# EAGLE design Wallboxsteuerung-WEMOS-ohne-shelly2 (EAGLE 7.5.0)
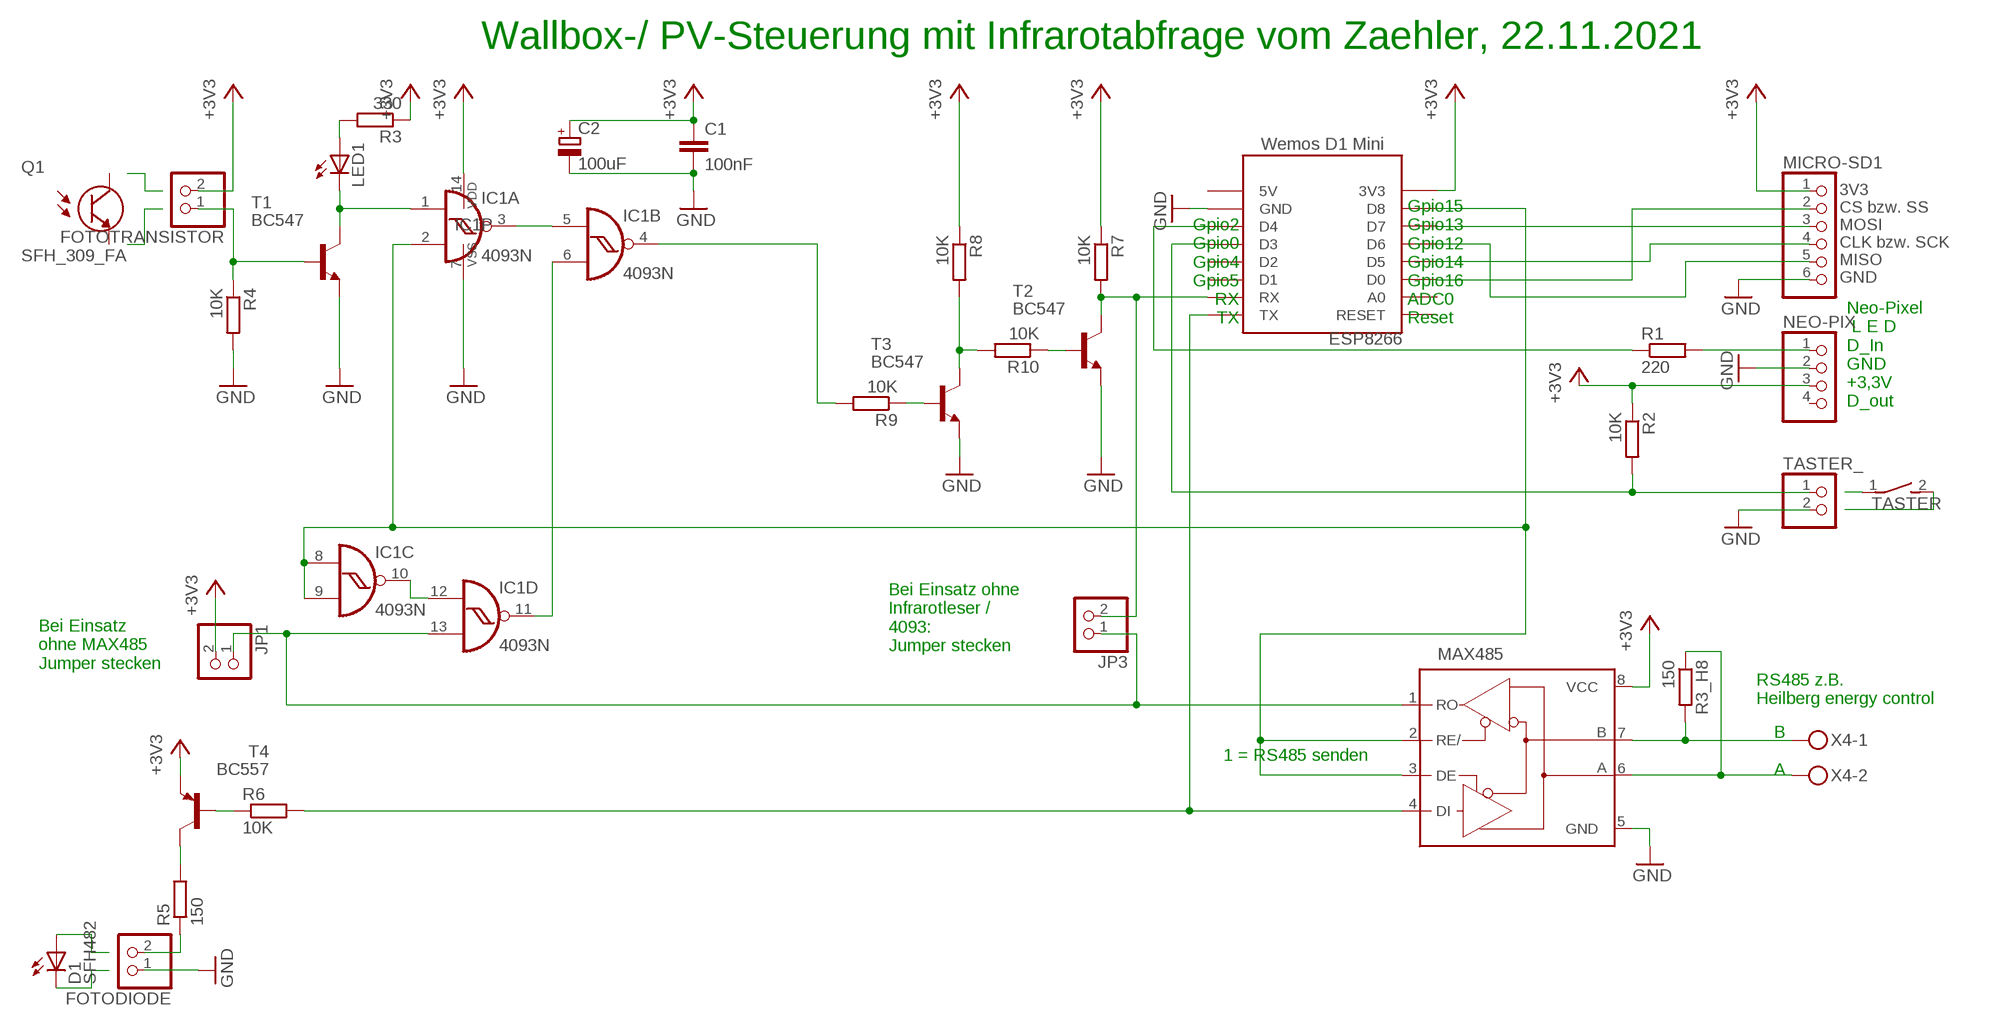
[diagram p0: schematic, sheet 1]

## Parts
C1  100nF  C-EU050-045X075  [C050-045X075]
C2  100uF  CPOL-EUE5-6  [E5-6]
D1  SFH482  [SFH482]
ESP8266  Wemos D1 Mini  WEMOS-D1-MINI  [WEMOS-D1-MINI]
FOTODIODE  PINHD-1X2  [1X02]
FOTOTRANSISTOR  PINHD-1X2  [1X02]
IC1  4093N  [DIL14]
JP1  PINHD-1X2  [1X02]
JP3  PINHD-1X2  [1X02]
LED1  LED5MM  [LED5MM]
MAX485  MAX3468CPA  [DIL08]
MICRO-SD1  PINHD-1X6  [1X06]
NEO-PIX  PINHD-1X4  [1X04]
Q1  SFH_309_FA  [XDCR_SFH_309_FA]
R1  220  R-EU_0309/V  [0309V]
R2  10K  R-EU_0309/V  [0309V]
R3  330  R-EU_0309/V  [0309V]
R3_H8  150  R-EU_0309/V  [0309V]
R4  10K  R-EU_0309/V  [0309V]
R5  150  R-EU_0309/V  [0309V]
R6  10K  R-EU_0309/V  [0309V]
R7  10K  R-EU_0309/V  [0309V]
R8  10K  R-EU_0309/V  [0309V]
R9  10K  R-EU_0309/V  [0309V]
R10  10K  R-EU_0309/V  [0309V]
T1  BC547  [TO92]
T2  BC547  [TO92]
T3  BC547  [TO92]
T4  BC557  [TO92]
TASTER  DS01E  [DS-01]
TASTER_  PINHD-1X2  [1X02]
X4  MKDSN1,5/2-5,08  [MKDSN1,5/2-5,08]

## Nets
+3V3: C1.1 C2.+ ESP8266.3V3 FOTOTRANSISTOR.2 IC1.14(P:VDD) JP1.2 MAX485.8(VCC) MICRO-SD1.1 NEO-PIX.3 R2.1 R3.1 R7.1 R8.1 T4.1(E)
GND: C1.2 C2.- ESP8266.GND FOTODIODE.1 IC1.7(P:VSS) MAX485.5(GND) MICRO-SD1.6 NEO-PIX.2 R4.2 T1.1(E) T2.1(E) T3.1(E) TASTER_.2
N$1: ESP8266.D4 R1.1
N$2: FOTOTRANSISTOR.1 R4.1 T1.2(B)
N$3: IC1.1(A:I0) LED1.K(C) T1.3(C)
N$4: IC1.3(A:O) IC1.5(B:I0)
N$5: ESP8266.D8 IC1.2(A:I1) IC1.8(C:I0) IC1.9(C:I1) MAX485.2(RE/) MAX485.3(DE)
N$6: R5.2 T4.3(C)
N$7: IC1.4(B:O) R9.2
N$8: ESP8266.TX MAX485.4(DI) R6.2
N$9: IC1.6(B:I1) IC1.11(D:O)
N$11: FOTODIODE.2 R5.1
N$12: TASTER.2
N$13: D1.A
N$14: R6.1 T4.2(B)
N$15: TASTER.1
N$16: IC1.10(C:O) IC1.12(D:I0)
N$17: D1.K(C)
N$27: ESP8266.RX JP3.2 R7.2 T2.3(C)
N$29: R8.2 R10.2 T3.3(C)
N$30: R10.1 T2.2(B)
N$31: R9.1 T3.2(B)
N$32: LED1.A R3.2
N$33: IC1.13(D:I1) JP1.1 JP3.1 MAX485.1(RO)
N$39: NEO-PIX.1 R1.2
N$40: ESP8266.D3 R2.2 TASTER_.1
N$42: ESP8266.D0 MICRO-SD1.2
N$43: ESP8266.D7 MICRO-SD1.3
N$44: ESP8266.D5 MICRO-SD1.4
N$45: ESP8266.D6 MICRO-SD1.5
N$46: MAX485.7(B) R3_H8.2 X4.1
N$47: MAX485.6(A) R3_H8.1 X4.2
Unconnected: ESP8266.5V ESP8266.A0 ESP8266.D1 ESP8266.D2 ESP8266.RESET NEO-PIX.4 Q1.1(E) Q1.2(C)

## Notes on the sheet
- Wallbox-/ PV-Steuerung mit Infrarotabfrage vom Zaehler, 22.11.2021
- 3V3
  CS bzw. SS
  MOSI
  CLK bzw. SCK
  MISO
  GND
- Gpio2
  Gpio0
  Gpio4
  Gpio5
  RX
  TX
- Gpio15
  Gpio13
  Gpio12
  Gpio14
  Gpio16
  ADC0
  Reset
- Neo-Pixel
   L E D
  D_In
  GND
  +3,3V
  D_out
- Bei Einsatz ohne
  Infrarotleser /
  4093:
  Jumper stecken
- Bei Einsatz
  ohne MAX485
  Jumper stecken
- RS485 z.B. 
  Heilberg energy control
- 1 = RS485 senden
- B
  
  A

## Library data of the parts
C1 = rcl:C-EU: CAPACITOR, European symbol
C2 = rcl:CPOL-EU: POLARIZED CAPACITOR, European symbol
D1 = led:SFH482: IR LED infrared emitting diode, Infineon
ESP8266 = uwe_esp8266modules1:WEMOS-D1-MINI: WeMos.cc D1 mini ESP8266 module
FOTODIODE FOTOTRANSISTOR JP1 JP3 TASTER_ = pinhead:PINHD-1X2: PIN HEADER
IC1 = 40xx:4093: Quad 2-input NAND schmitt trigger
LED1 = led:LED: LED OSRAM: - CHIPLED LG R971, LG N971, LY N971, LG Q971, LY Q971, LO R971, LY R971 LH N974, LH R974 LS Q976, LO Q976, LY Q976 LO Q996 - Hyper CHIPLED LW Q18S LB Q993, LB Q99A, LB R99A - SideLED LS A670, LO A670, LY A670, LG A670, LP A670 LB A673, LV A673, LT A673, LW A673 LH A674 LY A675 LS A676, LA A676, LO A676, LY A676, LW A676 LS A679, LY A679, LG A679 - Hyper Micro SIDELED® LS Y876, LA Y876, LO Y876, LY Y876 LT Y87S - SmartLED LW L88C, LW L88S LB L89C, LB L89S, LG L890 LS L89K, LO L89K, LY L89K LS L896, LA L896, LO L896, LY L896 - TOPLED LS T670, LO T670, LY T670, LG T670, LP T670 LSG T670, LSP T670, LSY T670, LOP T670, LYG T670 LG T671, LOG T671, LSG T671 LB T673, LV T673, LT T673, LW T673 LH T674 LS T676, LA T676, LO T676, LY T676, LB T676, LH T676, LSB T676, LW T676 LB T67C, LV T67C, LT T67C, LS T67K, LO T67K, LY T67K, LW E67C LS E67B, LA E67B, LO E67B, LY E67B, LB E67C, LV E67C, LT E67C LW T67C LS T679, LY T679, LG T679 LS T770, LO T770, LY T770, LG T770, LP T770 LB T773, LV T773, LT T773, LW T773 LH T774 LS E675, LA E675, LY E675, LS T675 LS T776, LA T776, LO T776, LY T776, LB T776 LHGB T686 LT T68C, LB T68C - Hyper Mini TOPLED® LB M676 - Mini TOPLED Santana® LG M470 LS M47K, LO M47K, LY M47K Source: http://www.osram.convergy.de LUXEON: - LUMILED® LXK2-PW12-R00, LXK2-PW12-S00, LXK2-PW14-U00, LXK2-PW14-V00 LXK2-PM12-R00, LXK2-PM12-S00, LXK2-PM14-U00 LXK2-PE12-Q00, LXK2-PE12-R00, LXK2-PE12-S00, LXK2-PE14-T00, LXK2-PE14-U00 LXK2-PB12-K00, LXK2-PB12-L00, LXK2-PB12-M00, LXK2-PB14-N00, LXK2-PB14-P00, LXK2-PB14-Q00 LXK2-PR12-L00, LXK2-PR12-M00, LXK2-PR14-Q00, LXK2-PR14-R00 LXK2-PD12-Q00, LXK2-PD12-R00, LXK2-PD12-S00 LXK2-PH12-R00, LXK2-PH12-S00 LXK2-PL12-P00, LXK2-PL12-Q00, LXK2-PL12-R00 Source: www.luxeon.com KINGBRIGHT: KA-3528ASYC Source: www.kingbright.com
MAX485 = maxim:MAX34*: +5V, Fail-Safe, 40Mbps, Profibus RS-485/RS-422 Transceivers Source: MAX3465-MAX3469.pdf; OC_FARNELL: unknown; OC_NEWARK: unknown
MICRO-SD1 = pinhead:PINHD-1X6: PIN HEADER
NEO-PIX = pinhead:PINHD-1X4: PIN HEADER
Q1 = SFH_309_FA-V7:SFH_309_FA: Phototransistor IR Chip Silicon 900nm 2-Pin T-1; MANUFACTURER: OSRAM; PARTREV: 1.3; STANDARD: Manufacturer Recommendations
R1-R3 R3_H8 R4-R10 = rcl:R-EU_: RESISTOR, European symbol
T1-T3 = transistor-neu-to92:BC547: NPN TRANSISTOR
T4 = transistor-pnp:BC557: PNP Transistor
TASTER = switch-dil:DS01E: DIL/CODE SWITCH; OC_FARNELL: unknown; OC_NEWARK: unknown
X4 = con-phoenix-508:MKDSN1,5/2-5,08: MKDSN 1,5/ 2-5,08 Printklemme Nennstrom: 13,5 A Nennspannung: 250 V Rastermaß: 5,08 mm Polzahl: 2 Anschlussart: Schraubanschluss Montage: Löten Anschlussrichtung Leiter/Platine: 0 ° Artikelnummer: 1729128 Source: http://eshop.phoenixcontact.com .. 1729128.pdf

## Board
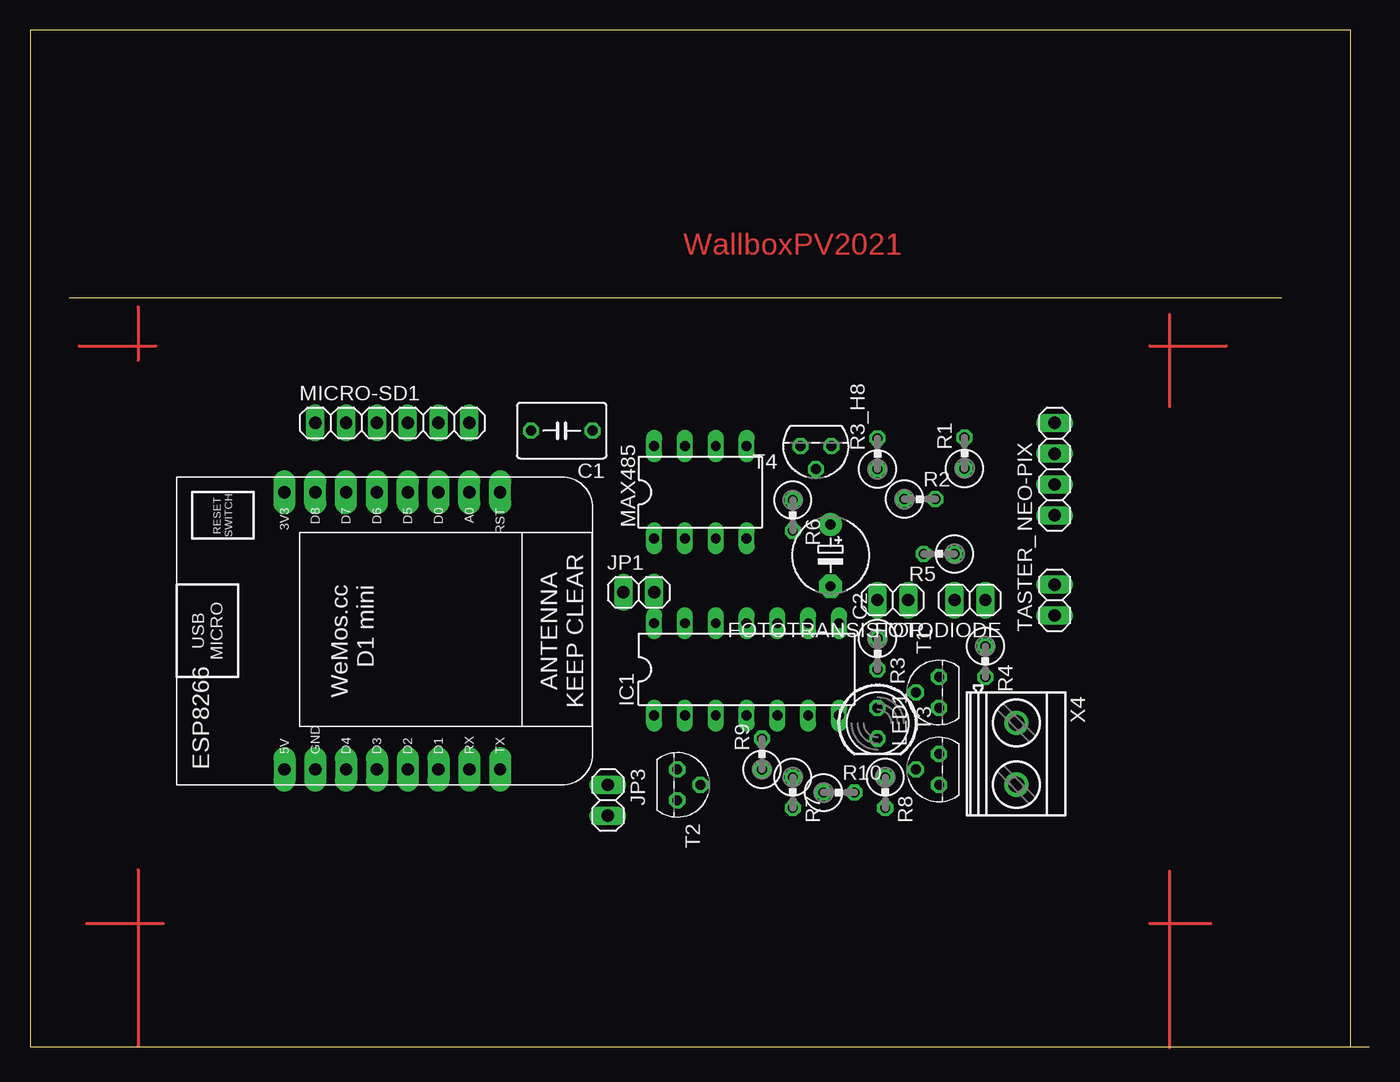
[diagram p1: board, top side]
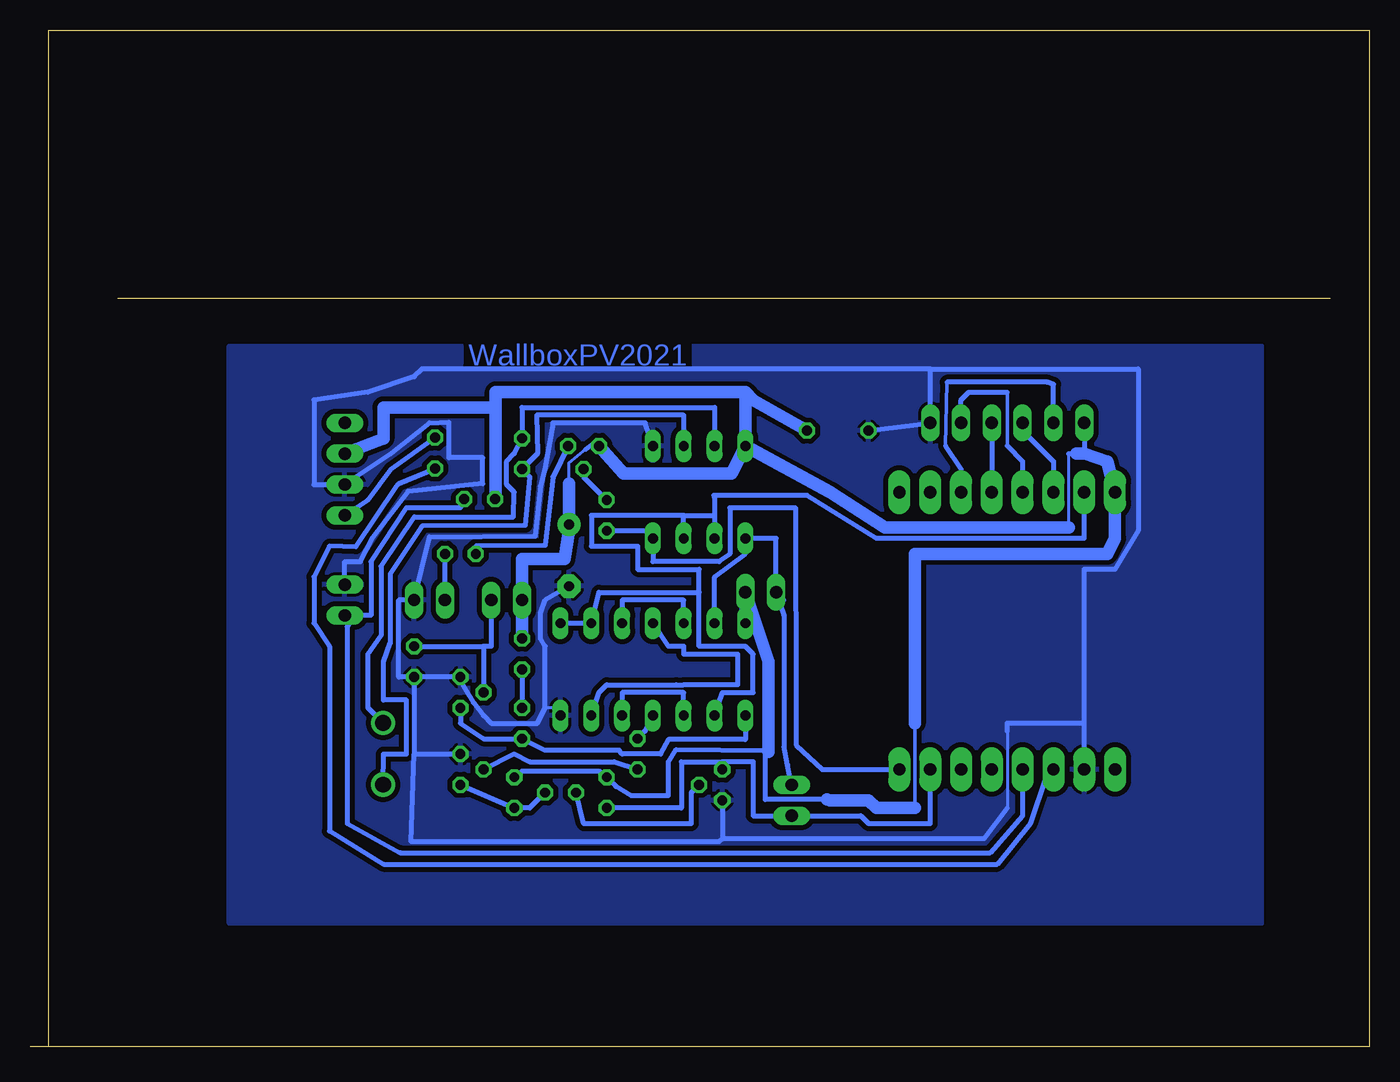
[diagram p2: board, bottom side, seen from below]

Size 110.39 x 83.81 mm. Coordinates in mm from the lower left corner, seen from the top.
Outline: 108.89,0 108.89,83.81 0,83.81 0,0 108.89,0
Outline: 108.89,0 110.39,0
Outline: 103.2,61.74 3.2,61.74
Copper layers (1*16): Top 0.035mm / dielectric 1.5mm / Bottom 0.035mm
Design rules "default": minimum track width 10mil, minimum drill 24mil, track to track 8mil, track to pad 8mil, pad to pad 8mil, via to via 8mil, smd to smd 8mil, copper to edge 40mil, drill to drill 8mil, minimum pad ring 10mil, minimum via ring 8mil, stop-mask expansion 4mil, vias tented up to drill 0mil, thermal gap 10mil

### Footprints (pad centres in the part's own frame; a part is rotated, then mirrored left to right if it is on the bottom)
C050-045X075 = drill 0.813 octagon: 1 -2.54,0; 2 2.54,0
E5-6 = drill 0.813 pad 1.905: + -2.54,0 | drill 0.813 pad 1.905 octagon: - 2.54,0
SFH482 = drill 0.813 long: A -1.27,0; K 1.27,0
WEMOS-D1-MINI = drill 1.016 pad 1.829 long: 3V3 -10.16,-10.16; 5V 12.7,-10.16; A0 -10.16,5.08; D0 -10.16,2.54; D1 12.7,2.54; D2 12.7,0; D3 12.7,-2.54; D4 12.7,-5.08; D5 -10.16,0; D6 -10.16,-2.54; D7 -10.16,-5.08; D8 -10.16,-7.62; GND 12.7,-7.62; RESET -10.16,7.62; RX 12.7,5.08; TX 12.7,7.62
1X02 = drill 1.016 long: 1 -1.27,0; 2 1.27,0
DIL14 = drill 0.813 long: 1 -7.62,-3.81; 2 -5.08,-3.81; 3 -2.54,-3.81; 4 0,-3.81; 5 2.54,-3.81; 6 5.08,-3.81; 7 7.62,-3.81; 8 7.62,3.81; 9 5.08,3.81; 10 2.54,3.81; 11 0,3.81; 12 -2.54,3.81; 13 -5.08,3.81; 14 -7.62,3.81
LED5MM = drill 0.813 octagon: A -1.27,0; K 1.27,0
DIL08 = drill 0.813 long: 1 -3.81,-3.81; 2 -1.27,-3.81; 3 1.27,-3.81; 4 3.81,-3.81; 5 3.81,3.81; 6 1.27,3.81; 7 -1.27,3.81; 8 -3.81,3.81
1X06 = drill 1.016 long: 1 -6.35,0; 2 -3.81,0; 3 -1.27,0; 4 1.27,0; 5 3.81,0; 6 6.35,0
1X04 = drill 1.016 long: 1 -3.81,0; 2 -1.27,0; 3 1.27,0; 4 3.81,0
XDCR_SFH_309_FA = drill 1 pad 2: 1 -1.27,0; 2 1.27,0
0309V = drill 0.813 octagon: 1 -1.27,0; 2 1.27,0
TO92 = drill 0.813 octagon: 1 1.27,0; 2 0,1.905; 3 -1.27,0
DS-01 = drill 0.813 long: 1 0,-3.81; 2 0,3.81
MKDSN1,5/2-5,08 = drill 1.3 pad 2: 1 -2.561,0.025; 2 2.519,0.025

### Placement (x,y rotation side)
C1  43.81,50.8 180 top
C2  65.98,40.51 270 top
D1  -89.53,-55.88 0 top  (outside the outline)
ESP8266  31.12,35.56 270 top
FOTODIODE  77.47,36.83 180 top
FOTOTRANSISTOR  71.12,36.83 180 top
IC1  59.05,31.11 0 top
JP1  50.16,37.46 0 top
JP3  47.62,20.32 270 top
LED1  69.85,26.67 270 top
MAX485  55.24,45.72 0 top
MICRO-SD1  29.84,51.44 0 top
NEO-PIX  84.45,47.62 90 top
Q1  -97.16,-55.88 0 top  (outside the outline)
R1  77.03,48.96 90 top
R2  73.34,45.15 0 top
R3  69.85,32.38 270 top
R3_H8  69.85,48.89 90 top
R4  78.74,31.75 270 top
R5  74.93,40.64 180 top
R6  62.87,43.81 270 top
R7  62.87,20.95 270 top
R8  70.48,20.95 270 top
R9  60.33,24.13 90 top
R10  66.67,20.95 0 top
T1  74.93,29.21 90 top
T2  53.34,21.59 270 top
T3  74.93,22.86 90 top
T4  64.77,49.53 180 top
TASTER  -71.75,-11.43 0 top  (outside the outline)
TASTER_  84.45,36.83 90 top
X4  81.28,24.13 270 top

### Tracks (layer width: path | path; a pad name or v marks a point on that pad's centre or on a via)
+3V3
  Bottom 0.254: 24.77,42.8 24.77,48.89 | 65.98,46.42 65.98,48.13 64.58,49.28
  Bottom 0.305: 37.47,26.67 37.47,19.68
  Bottom 0.406: MICRO-SD1.1 23.5,48.89 | 24.77,48.89 24.13,48.89 | 64.58,49.28 63.75,49.91 T4.1 | 44.7,20.38 49.78,20.38 49.78,24.45 | 49.78,24.45 49.53,24.32 49.53,24.13 49.78,24.45 | 49.78,24.45 57.15,24.51 57.79,23.49 57.79,20.7 60.83,20.7 62.1,21.46 63.5,22.73 | 63.5,22.73 R7.1 | R8.1 69.85,22.73 63.5,22.73 | 72.01,45.4 71.75,45.72 R2.1 | C2.+ 65.98,42.55
  Bottom 1.016: MAX485.8 44.45,45.72 39.94,42.8 24.77,42.8 | 24.13,48.89 23.5,48.89 21.59,48.26 ESP8266.3V3 20.95,41.91 21.59,40.64 37.47,40.64 37.47,26.67 | IC1.14 JP1.2 49.53,31.75 49.53,24.32 | T4.1 61.47,47.24 52.58,47.24 MAX485.8 | R3.1 FOTOTRANSISTOR.2 69.85,40.2 66.36,40.2 65.98,42.55 65.98,46.42 | 51.44,53.98 72.01,53.98 72.01,52.7 | 51.44,53.98 50.8,53.34 C1.1 | 51.44,53.98 MAX485.8 | 72.01,45.4 72.01,52.7 | 37.47,19.68 40.64,19.68 41.27,20.32 44.45,20.32 44.7,20.38 | 72.01,52.7 81.28,52.7 81.28,50.16 NEO-PIX.3
GND
  Bottom 0.254: 66.67,27.94 67.94,27.94 | 29.84,26.67 29.84,19.68
  Bottom 0.406: R4.2 T1.1 74.99,30.42 74.99,30.29 73.85,28.38 73.03,27.3 72.39,26.67 68.58,26.67 67.94,27.94 67.94,33.02 68.33,33.66 68.33,35.75 67.94,36.83 C2.- | IC1.7 66.67,27.94 | 36.2,55.88 19.05,55.88 19.05,42.55 20.95,39.37 23.5,39.37 23.5,26.67 | MAX485.5 59.69,51.44 67.31,51.44 67.94,47.75 68.33,46.23 68.77,42.1 77.47,42.04 FOTODIODE.1 80.01,36.83 80.01,30.48 R4.2 | TASTER_.2 84.45,40.01 83.19,40.01 82.17,41.97 79.25,45.78 73.09,46.42 73.09,48.58 75.88,48.58 75.88,51.5 77.47,51.44 80.64,48.89 NEO-PIX.2 87,46.35 87,53.34 82.55,53.98 78.74,55.24 78.11,55.88 36.2,55.88 | 36.2,55.88 MICRO-SD1.6 C1.2 | T2.1 53.34,17.14 | 53.34,17.14 53.59,16.89 78.99,16.89 78.74,24.13 | 78.74,24.13 T3.1 | R4.2 78.74,24.13 | 23.5,26.67 29.84,26.67 29.84,26.04 | 29.84,19.68 31.75,17.14 53.34,17.14 | ESP8266.GND 23.5,26.67
  pour Bottom (isolate 0.406): 8.89,57.78 8.89,10.16 93.98,10.16 93.98,57.78
N$1
  Bottom 0.406: ESP8266.D4 26.67,22.22 27.94,18.41 30.67,15.05 81.28,15.05 85.72,17.78 85.72,33.02 87,34.92 87,38.73 85.72,41.27 83.57,41.21 80.2,46.23 80.01,46.42 R1.1
N$2
  Bottom 0.406: R4.1 73.03,33.02 | 73.03,33.02 72.39,33.02 FOTOTRANSISTOR.1 | 73.03,33.02 T1.2
N$3
  Bottom 0.406: T1.3 74.93,26.67 73.03,25.4 LED1.K 67.94,24.45 61.85,24.45 61.59,24.13 58.42,24.13 57.79,25.34 51.44,25.34 IC1.1
N$4
  Bottom 0.406: IC1.3 56.52,29.21 61.59,29.21 IC1.5
N$5
  Bottom 0.406: IC1.8 IC1.9 63.5,37.46 55.24,37.46 | ESP8266.D8 23.5,41.91 40.64,41.91 46.36,45.47 54.04,45.47 53.98,45.09 53.98,43.81 | 56.52,43.81 64.13,43.81 64.13,41.27 60.33,41.27 60.33,39.37 55.24,39.37 55.24,37.46 | 53.98,43.81 MAX485.2 | MAX485.3 56.52,43.81 | 56.52,43.81 53.98,43.81 | IC1.2 53.34,29.21 50.8,29.21 50.8,32.38 51.44,33.02 55.24,33.02 55.24,37.46
N$6
  Bottom 0.406: T4.3 67.31,46.99 67.94,41.34 73.66,41.27 R5.2
N$7
  Bottom 0.406: IC1.4 59.69,26.04 R9.2
N$8
  Bottom 0.406: R6.2 59.05,42.55 MAX485.4 59.05,40.01 53.59,40.01 52.7,40.64 52.7,44.45 47.31,44.45 47.24,27.3 47.24,24.89 45.09,22.86 ESP8266.TX
N$9
  Bottom 0.406: IC1.6 63.5,29.21 62.87,29.84 57.15,29.84 56.52,29.84 52.07,29.84 52.07,32.38 56.52,32.38 56.52,33.02 57.79,33.02 IC1.11
N$10
  Top 0.254: 8.89,61.02 8.89,56.58
N$11
  Bottom 0.406: FOTODIODE.2 R5.1
N$14
  Bottom 0.406: R6.1 64.77,46.99 T4.2
N$16
  Bottom 0.406: IC1.12 56.52,36.83 61.59,36.83 IC1.10
N$18
  Top 0.254: 93.92,60.39 93.92,52.77
N$19
  Top 0.254: 92.27,57.78 98.61,57.78
N$20
  Top 0.254: 92.27,10.16 97.35,10.16
N$23
  Top 0.254: 8.89,14.61 8.89,0
N$24
  Top 0.254: 93.92,14.48 93.92,-0.13
N$25
  Top 0.254: 4.64,10.16 10.99,10.16
N$26
  Top 0.254: 4,57.78 10.35,57.78
N$27
  Bottom 0.406: ESP8266.RX 36.2,18.41 41.27,18.41 41.91,19.05 JP3.2 50.8,19.05 50.8,23.49 53.34,23.49 | R7.2 56.71,19.68 56.71,23.49 53.34,23.49 | 53.34,23.49 T2.3
N$29
  Bottom 0.406: T3.3 R8.2 69.22,19.68 R10.2
N$30
  Bottom 0.406: R10.1 64.77,18.41 55.88,18.41 55.88,20.95 T2.2
N$31
  Bottom 0.406: T3.2 70.48,24.13 69.22,23.49 62.23,23.49 R9.1
N$32
  Bottom 0.406: R3.2 LED1.A
N$33
  Bottom 0.406: JP1.1 48.26,35.56 48.25,24.79 47.94,23.24 JP3.1 | 48.26,36.83 JP1.1 | JP1.1 48.9,41.91 MAX485.1 51.44,40.64 53.98,38.73 IC1.13
N$39
  Bottom 0.406: NEO-PIX.1 82.55,45.09 80.64,47.62 R1.2
N$40
  Bottom 0.406: ESP8266.D3 28.57,19.05 31.24,16 79.88,16 84.26,18.41 84.26,34.54 83.82,35.56 | 83.82,35.56 82.3,35.56 82.3,40.01 79.38,44.45 74.93,44.45 R2.2 | 83.82,35.56 TASTER_.1
N$42
  Bottom 0.305: 34.8,54.8 34.92,49.53
  Bottom 0.406: MICRO-SD1.2 26.04,54.61 26.54,54.8 34.8,54.8 | 34.92,49.53 33.66,47.62 ESP8266.D0
N$43
  Bottom 0.406: MICRO-SD1.3 28.57,50.8 26.04,48.26 ESP8266.D7
N$44
  Bottom 0.406: MICRO-SD1.4 ESP8266.D5
N$45
  Bottom 0.305: 29.84,53.98 29.84,49.53
  Bottom 0.406: MICRO-SD1.5 33.66,53.34 33.02,53.98 29.84,53.98 | 29.84,49.53 28.57,48.26 ESP8266.D6
N$46
  Bottom 0.406: X4.1 82.55,27.94 82.55,32.38 81.47,33.91 81.47,39.62 78.74,43.69 70.55,43.69 70.48,45.72 71.12,46.35 71.12,48.26 70.48,48.89 R3_H8.2 69.85,52.7 53.98,52.7 MAX485.7
N$47
  Bottom 0.406: X4.2 81.28,24.13 79.38,24.13 79.38,28.57 81.28,28.57 81.28,31.75 80.71,33.27 80.71,38.99 78.11,42.93 69.6,42.99 69.22,46.99 R3_H8.1 68.58,48.89 68.64,52.07 56.52,52.07 MAX485.6

### Text on the board
Top: WallboxPV2021
Bottom: WallboxPV2021